# Altium project mlx-brd1_v091.PrjPcb
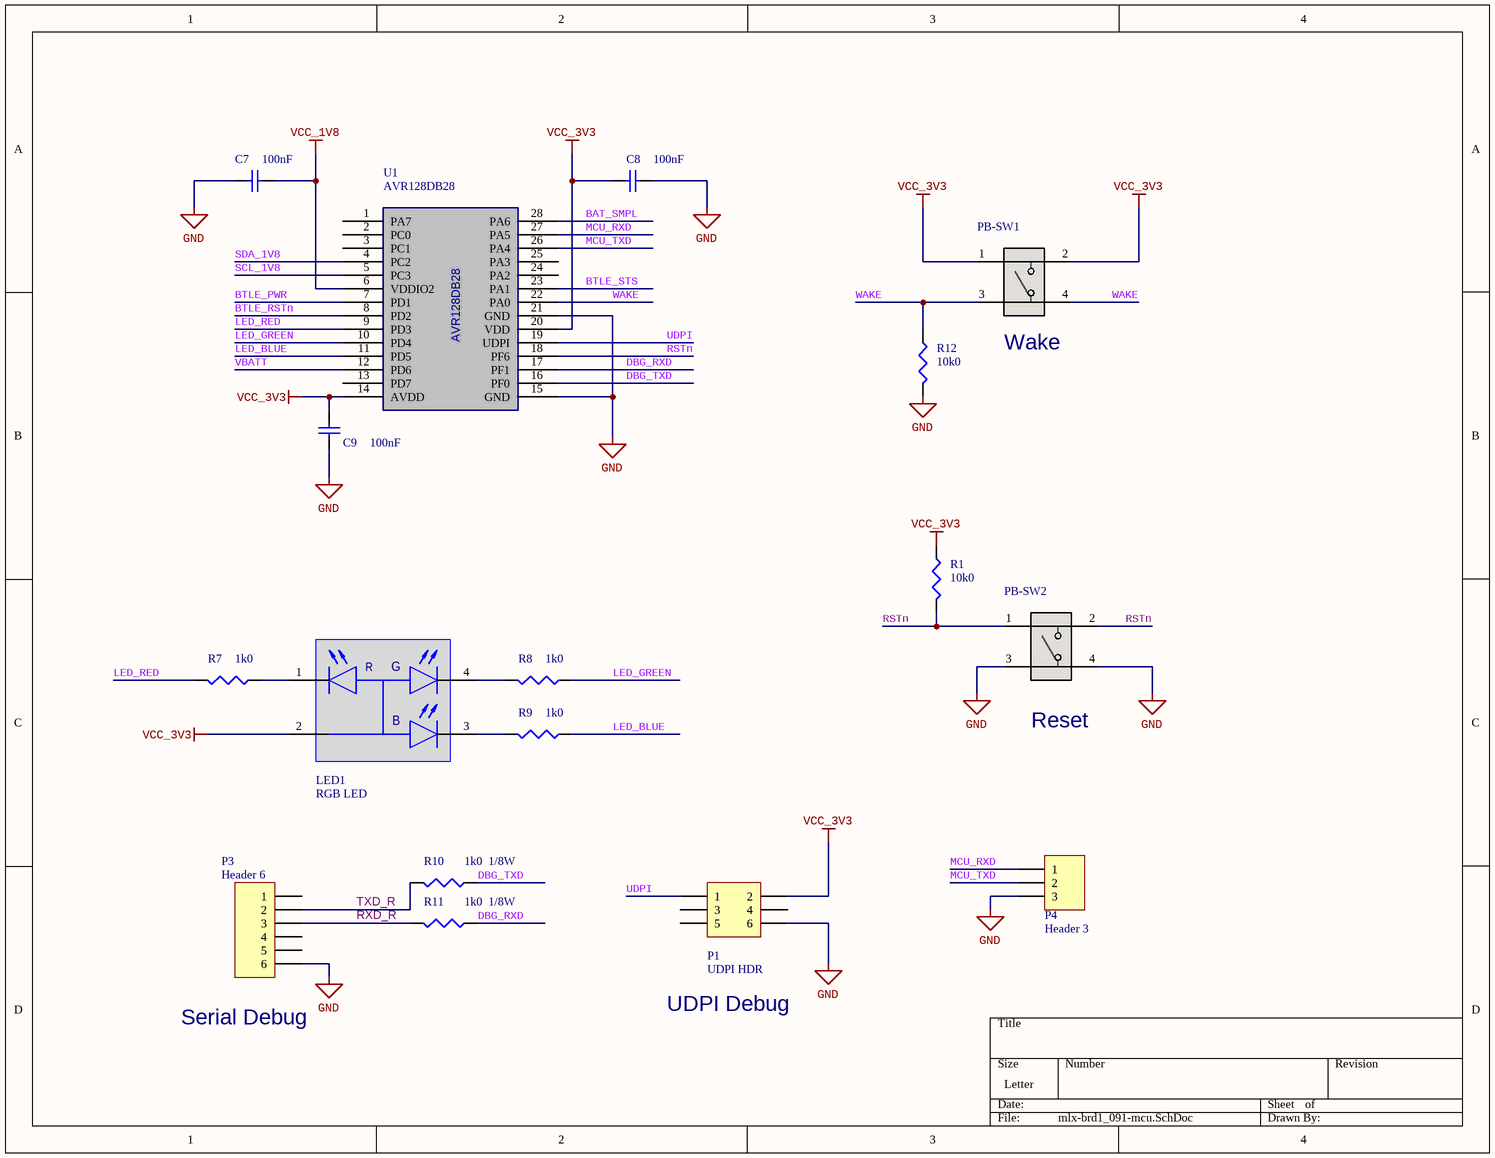
[diagram p0: mlx-brd1_091-mcu.SchDoc]
2 sheets, 47 parts. Net scope: global (net labels, ports and power ports of the same name join across sheets).
Board file: mlx-brd1_091.PcbDoc
Sheets:
  mlx-brd1_091-mcu.SchDoc
  mlx-brd1_091-sensor.SchDoc

## Sheet mlx-brd1_091-mcu.SchDoc
size Letter

### Parts
C7  100nF  [CAPC1608N]
C8  100nF  [CAPC1608N]
C9  100nF  [CAPC1608N]
LED1  RGB LED  [SOL150P350X210-4N]
P1  UDPI HDR  [HDR2X3]
P3  Header 6  [HDR1X6]
P4  Header 3  [HDR1X3]
PB-SW1  PTS645SM43SMTR92LFS  [SWITCH_43SMTR92LFS]  (value not drawn)
PB-SW2  PTS645SM43SMTR92LFS  [SWITCH_43SMTR92LFS]  (value not drawn)
R1  10k0  [RESC1608N]
R7  1k0  [RESC1608N]
R8  1k0  [RESC1608N]
R9  1k0  [RESC1608N]
R10  value 1k0  1/8W  [RESC1608N]  (hidden comment: Res3)
R11  value 1k0  1/8W  [RESC1608N]  (hidden comment: Res3)
R12  10k0  [RESC1608N]
U1  AVR128DB28  [AVR128DB28_SOIC28]

### Nets
GND: C7.2 C8.1 C9.1 P1.6 P3.6 P4.3 PB-SW2.3 PB-SW2.4 R12.2 U1.15(GND) U1.21(GND)
VCC_1V8: C7.1 U1.6(VDDIO2)
VCC_3V3: C8.2 C9.2 LED1.2(CA) P1.2 PB-SW1.1 PB-SW1.2 R1.1 U1.14(AVDD) U1.20(VDD)
BAT_SMPL: U1.28(PA6)
BTLE_PWR: U1.7(PD1)
BTLE_RSTn: U1.8(PD2)
BTLE_STS: U1.23(PA1)
DBG_RXD: R11.1 U1.17(PF1)
DBG_TXD: R10.1 U1.16(PF0)
LED_BLUE: R9.1 U1.11(PD5)
LED_GREEN: R8.1 U1.10(PD4)
LED_RED: R7.2 U1.9(PD3)
MCU_RXD: P4.1 U1.27(PA5)
MCU_TXD: P4.2 U1.26(PA4)
RSTn: PB-SW2.1 PB-SW2.2 R1.2 U1.18(PF6)
RXD_R: P3.3 R11.2
SCL_1V8: U1.5(PC3)
SDA_1V8: U1.4(PC2)
TXD_R: P3.2 R10.2
UDPI: P1.1 U1.19(UDPI)
VBATT: U1.12(PD6)
WAKE: PB-SW1.3 PB-SW1.4 R12.1 U1.22(PA0)
NetLED1_1: LED1.1(RED_C) R7.1
NetLED1_3: LED1.3(BLUE_C) R9.2
NetLED1_4: LED1.4(GREEN_C) R8.2

Not connected (* = marked no-connect by the designer): P1 3 4 5; P3 1 4 5; U1 1(PA7) 2(PC0) 3(PC1) 13(PD7) 24(PA2) 25(PA3)

### Notes on the sheet
- (near PB-SW1) Wake
- (near PB-SW2) Reset
- (near P3) Serial Debug
- UDPI Debug
- (in symbol CLVBA-FKA-CAEDH8BBB7A363) R; G; B

### Library data of the parts
C7-C9 = Cap: Capacitor; Manufacturer: Yageo; MPN: CC0603KPX7R9BB104; Value: CAP CER 0.1UF 50V X7R 0603; Digi-Key PN: 311-3567-1-ND
LED1 = CLVBA-FKA-CAEDH8BBB7A363: Red, Green, Blue _RGB_ 622nm Red, 530nm Green, 470nm Blue LED Indication - Discrete 1.9V Red, 3V Green, 3V Blue 4-PLCC; Manufacturer: CreeLED, Inc.; Value: LED RGB DIFFUSED 4PLCC SMD; Digi-Key PN: CLVBA-FKA-CAEDH8BBB7A363CT-ND; MPN: CLVBA-FKA-CAEDH8BBB7A363
P1 = Header 3X2: Header, 3-Pin, Dual row; Digi-Key PN: n/a; Value: n/a; Manufacturer: n/a; MPN: n/a
P3 = Header 6: Header, 6-Pin
P4 = Header 3: Header, 3-Pin
PB-SW1 PB-SW2 = PTS645SM43SMTR92LFS: No Description Available; Manufacturer: C&K; Value: SWITCH TACTILE SPST-NO 0.05A 12V; Digi-Key PN: CKN9112CT-ND; MPN: PTS645SM43SMTR92LFS
R1 R7-R9 R12 = Res3: Resistor; Manufacturer: Stackpole Electronics Inc; MPN: CF18JT10K0; Value: RES 10K OHM 1/8W 5% CF AXIAL; Digi-Key PN: CF18JT10K0CT-ND
R10 R11 = Res3: Manufacturer: Stackpole; MPN: CF18JT1K00; Digi-Key PN: CF18JT1K00CT-ND
U1 = AVR128DB28: 28 SDIP AVR DB microcontroller; Manufacturer: Microchip Technology; value: AVR DB Microcontroller; MPN: AVR128DB28

## Sheet mlx-brd1_091-sensor.SchDoc
size Letter
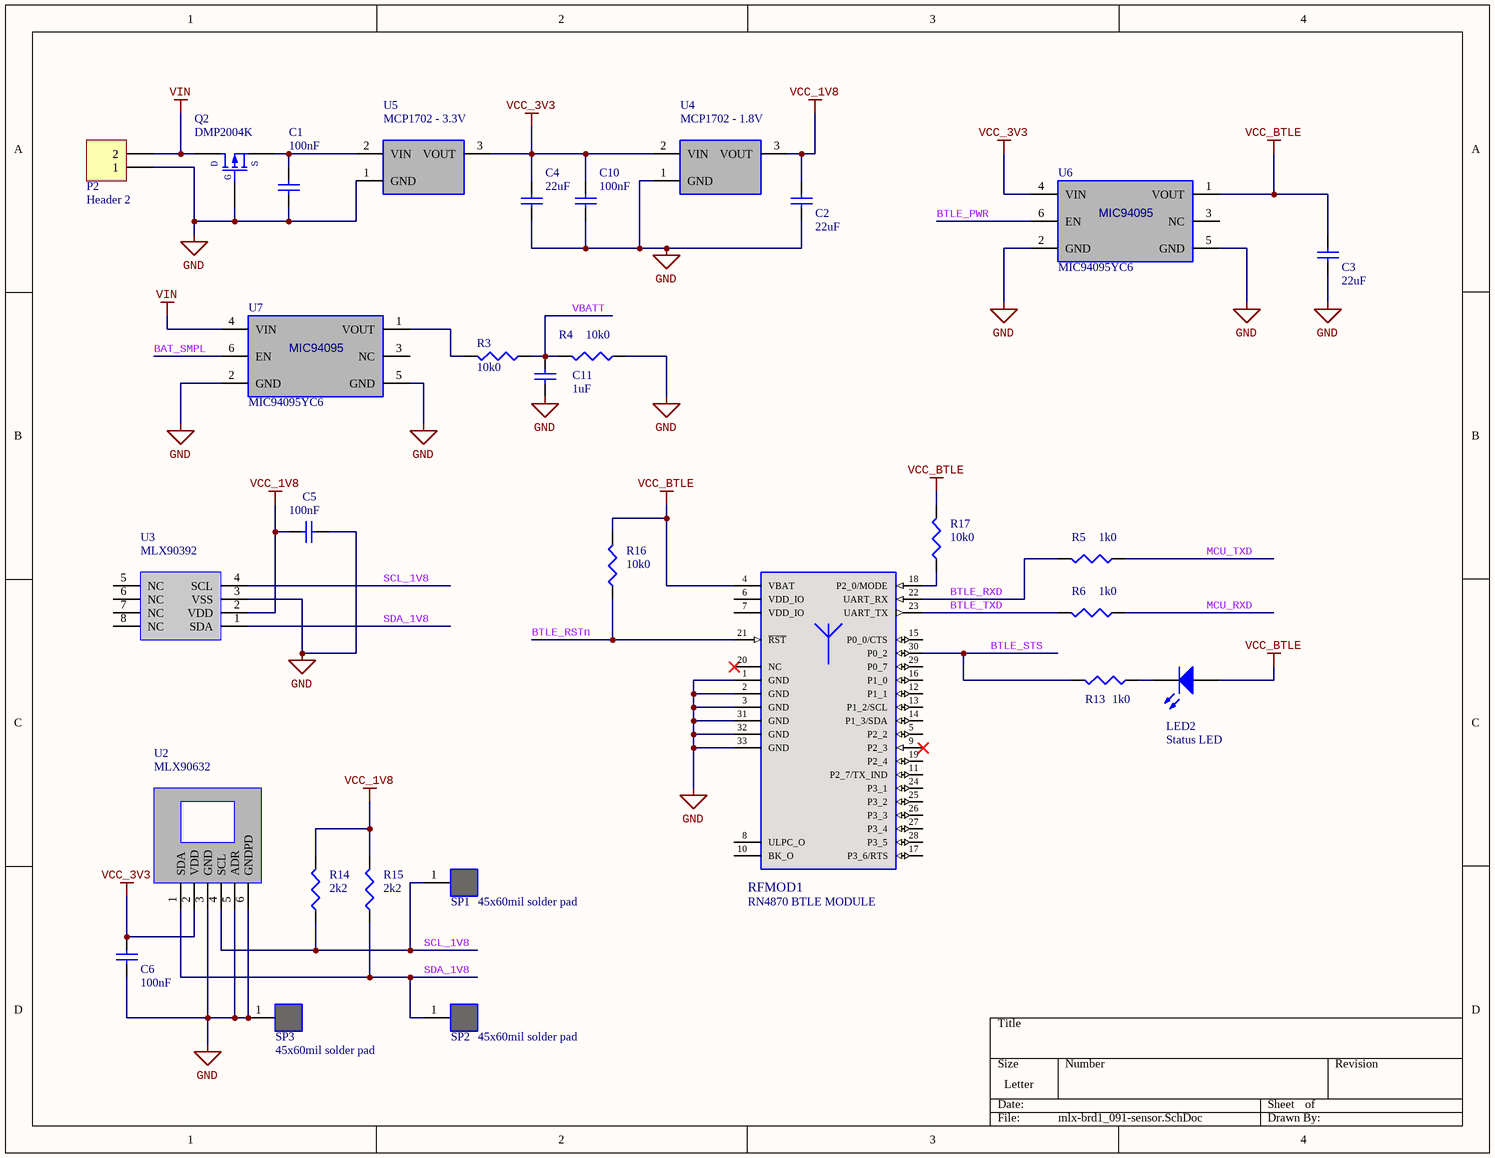
[diagram p1: mlx-brd1_091-sensor.SchDoc]

### Parts
C1  100nF  [CAPC1608N]
C2  22uF  [CAPC3216N]
C3  22uF  [CAPC3216N]
C4  22uF  [CAPC3216N]
C5  100nF  [CAPC1608N]
C6  100nF  [CAPC1608N]
C10  100nF  [CAPC1608N]
C11  1uF  [CAPC1608N]
LED2  Status LED  [3.2X1.6X1.1]
P2  Header 2  [HDR1X2]
Q2  DMP2004K  [SOT23-3N]
R3  10k0  [RESC1608N]
R4  10k0  [RESC1608N]
R5  1k0  [RESC1608N]
R6  1k0  [RESC1608N]
R13  1k0  [RESC1608N]
R14  2k2  [RESC1608N]
R15  2k2  [RESC1608N]
R16  10k0  [RESC1608N]
R17  10k0  [RESC1608N]
RFMOD1  RN4870 BTLE MODULE  [AP6-00539]
SP1  45x60mil solder pad  [sp45x60]
SP2  45x60mil solder pad  [sp45x60]
SP3  45x60mil solder pad  [sp45x60]
U2  MLX90632  [MLX90632_FIR_M2]
U3  MLX90392  [UTDFN8_2.5x2x0.4V2]
U4  MCP1702 - 1.8V  [MC1702-TO92]
U5  MCP1702 - 3.3V  [MC1702-TO92]
U6  MIC94095YC6  [SC-70]
U7  MIC94095YC6  [SC-70]

### Nets
GND: C1.1 C2.1 C3.1 C4.1 C5.1 C6.1 C10.1 C11.1 P2.1 Q2.1(G) R4.1 RFMOD1.1(GND) RFMOD1.2(GND) RFMOD1.3(GND) RFMOD1.31(GND) RFMOD1.32(GND) RFMOD1.33(GND) SP3.1 U2.3(GND) U2.5(ADR) U2.6(GNDPD) U3.3(VSS) U4.1(GND) U5.1(GND) U6.2(GND) U6.5(GND) U7.2(GND) U7.5(GND)
VCC_1V8: C2.2 C5.2 R14.2 R15.2 U3.2(VDD) U4.3(VOUT)
VCC_3V3: C4.2 C6.2 C10.2 U2.2(VDD) U4.2(VIN) U5.3(VOUT) U6.4(VIN)
VCC_BTLE: C3.2 LED2.1(A) R16.2 R17.2 RFMOD1.4(VBAT) U6.1(VOUT)
VIN: P2.2 Q2.3(D) U7.4(VIN)
BAT_SMPL: U7.6(EN)
BTLE_PWR: U6.6(EN)
BTLE_RSTn: R16.1 RFMOD1.21(~{RST})
BTLE_RXD: R5.2 RFMOD1.22(UART_RX)
BTLE_STS: R13.2 RFMOD1.30(P0_2)
BTLE_TXD: R6.2 RFMOD1.23(UART_TX)
MCU_RXD: R6.1
MCU_TXD: R5.1
SCL_1V8: R14.1 SP1.1 U2.4(SCL) U3.4(SCL)
SDA_1V8: R15.1 SP2.1 U2.1(SDA) U3.1(SDA)
VBATT: C11.2 R3.1 R4.2
NetC1_2: C1.2 Q2.2(S) U5.2(VIN)
NetLED2_2: LED2.2(K) R13.1
NetR3_2: R3.2 U7.1(VOUT)
NetR17_1: R17.1 RFMOD1.18(P2_0/MODE)

Not connected (* = marked no-connect by the designer): RFMOD1 5(P2_2) 6(VDD_IO) 7(VDD_IO) 8(ULPC_O) 9(P2_3)* 10(BK_O) 11(P2_7/TX_IND) 12(P1_1) 13(P1_2/SCL) 14(P1_3/SDA) 15(P0_0/CTS) 16(P1_0) 17(P3_6/RTS) 19(P2_4) 20(NC)* 24(P3_1) 25(P3_2) 26(P3_3) 27(P3_4) 28(P3_5) 29(P0_7); U3 5(NC) 6(NC) 7(NC) 8(NC); U6 3(NC); U7 3(NC)

### Notes on the sheet
- (in symbol MIC94095YC6) MIC94095

### Library data of the parts
C1 C5 C6 C10 = Cap: as C7 on sheet mlx-brd1_091-mcu; Digi-Key PN: 311-3567-1-ND
C2-C4 = Cap: Capacitor; Manufacturer: Yageo; MPN: CC1206MKX5R6BB226; Value: CAP CER 22UF 10V X5R 1206; Digi-Key PN: 311-1995-1-ND
C11 = Cap: Capacitor; Manufacturer: Taiyo Yuden; MPN: LMK107B7105KA-T; Value: CAP CER 1UF 10V X7R 0603; Digi-Key PN: 587-1242-1-ND
LED2 = LED1: Typical RED GaAs LED; Manufacturer: Inolux; MPN: IN-S126ATA; Value: LED AMBER CLEAR 1206 SMD; Digi-Key PN: 1830-1091-1-ND
P2 = Header 2: Header, 2-Pin; Digi-Key PN: n/a; Manufacturer: n/a; MPN: n/a; Value: n/a
Q2 = DMP2004K: P-Channel MOSFET; Manufacturer: Diodes Incorporated; MPN: DMP2004K-7; Value: MOSFET P-CH 20V 600MA SOT23-3; Digi-Key PN: DMP2004KDICT-ND
R3-R6 R13-R17 = Res3: as R1 on sheet mlx-brd1_091-mcu; Digi-Key PN: CF18JT10K0CT-ND
RFMOD1 = RN4870-V: Bluetooth LE Module; Manufacturer: Microchip Technology; MPN: RN4870-V/RM140; Value: RX TXRX MODULE BLE CHIP SMD; Digi-Key PN: 150-RN4870-V/RM140-ND
SP1-SP3 = sp45x60
U2 = MLX90632-FIR: Manufacturer: Melexis; MPN: MLX90632-S-LD-DCB-100; Value: FIR sensor; Digi-Key PN: n/a
U3 = MLX90392-mag: Manufacturer: Melexis; MPN: MLX90392ELQ-AAA-010-RE; Value: 3D Magnetometer; Digi-Key PN: n/a
U4 = MCP1702-TO92: Manufacturer: Microchip Technology; MPN: MCP1702-3302E/TO; Value: Linear Voltage Regulator IC Positive Fixed 1 Output 250mA TO-92-3; Digi-Key PN: MCP1702-3302E/TO-ND
U5 = MCP1702-TO92: Manufacturer: Microchip Technology; MPN: MCP1702-1802E/TO; Value: Linear Voltage Regulator IC Positive Fixed 1 Output 200mA TO-92-3; Digi-Key PN: MCP1702-1802E/TO-ND
U6 U7 = MIC94095YC6: Manufacturer: Microchip Technology; MPN: MIC94095YC6-TR; Value: Power Switch/Driver 1:1 P-Channel 1.2A SC-70-6; Digi-Key PN: 576-3494-1-ND

## Nets that join several sheets
GND: mlx-brd1_091-mcu (11 pins), mlx-brd1_091-sensor (28 pins)
VCC_1V8: mlx-brd1_091-mcu (C7.1 U1.6), mlx-brd1_091-sensor (6 pins)
VCC_3V3: mlx-brd1_091-mcu (9 pins), mlx-brd1_091-sensor (7 pins)
BAT_SMPL: mlx-brd1_091-mcu (U1.28), mlx-brd1_091-sensor (U7.6)
BTLE_PWR: mlx-brd1_091-mcu (U1.7), mlx-brd1_091-sensor (U6.6)
BTLE_RSTn: mlx-brd1_091-mcu (U1.8), mlx-brd1_091-sensor (R16.1 RFMOD1.21)
BTLE_STS: mlx-brd1_091-mcu (U1.23), mlx-brd1_091-sensor (R13.2 RFMOD1.30)
MCU_RXD: mlx-brd1_091-mcu (P4.1 U1.27), mlx-brd1_091-sensor (R6.1)
MCU_TXD: mlx-brd1_091-mcu (P4.2 U1.26), mlx-brd1_091-sensor (R5.1)
SCL_1V8: mlx-brd1_091-mcu (U1.5), mlx-brd1_091-sensor (R14.1 SP1.1 U2.4 U3.4)
SDA_1V8: mlx-brd1_091-mcu (U1.4), mlx-brd1_091-sensor (R15.1 SP2.1 U2.1 U3.1)
VBATT: mlx-brd1_091-mcu (U1.12), mlx-brd1_091-sensor (C11.2 R3.1 R4.2)